# Altium schematic sheet SH2 - CONNECTORS.SchDoc: Connectors
size B; CheckedBy: Lance Bantoto; Engineer: Wolfgang Windholtz; Organization: UW Robotics; Address1: 200 University Avenue; Address2: Waterloo; Address3: Ontario; Address4: Canada N2L 3G6; Revision: 2; SheetNumber: 2; SheetTotal: 5
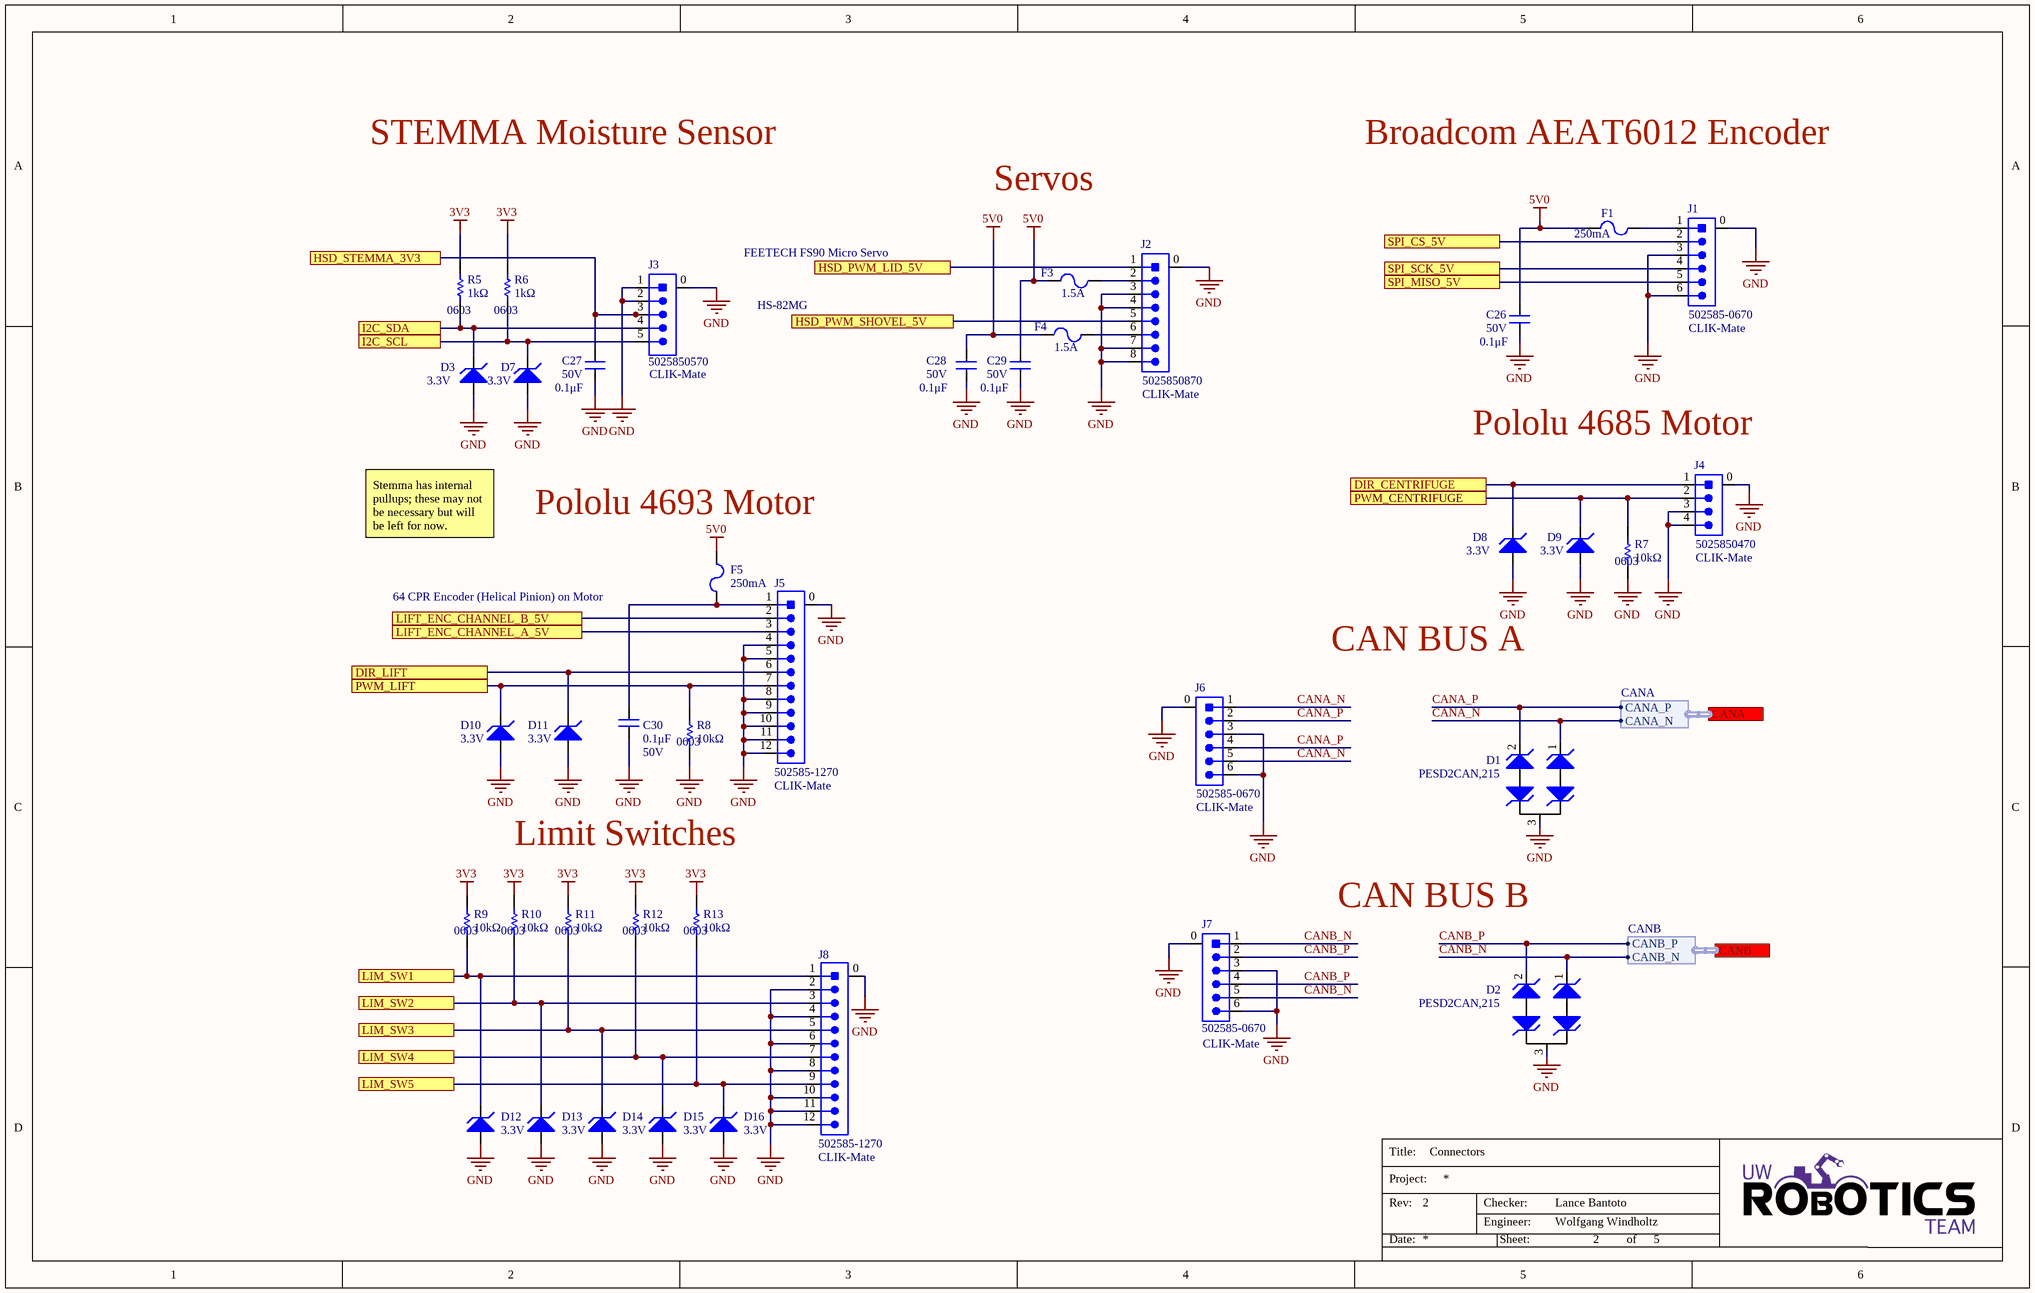
[diagram p0: SH2 - CONNECTORS.SchDoc]

## Parts
C26  value 0.1μF  Voltage Rating: 50V  [CAP0603]  (hidden comment: CAP_0.1uF_50V_0603)
C27  value 0.1μF  Voltage Rating: 50V  [CAP0603]  (hidden comment: CAP_0.1uF_50V_0603)
C28  value 0.1μF  Voltage Rating: 50V  [CAP0603]  (hidden comment: CAP_0.1uF_50V_0603)
C29  value 0.1μF  Voltage Rating: 50V  [CAP0603]  (hidden comment: CAP_0.1uF_50V_0603)
C30  value 0.1μF  Voltage Rating: 50V  [CAP0603]  (hidden comment: CAP_0.1uF_50V_0603)
D1  Manufacturer Part Number 1: PESD2CAN,215  [TVS_DIODE_CAN]  (hidden comment: TVS_DIODE_CAN)
D2  Manufacturer Part Number 1: PESD2CAN,215  [TVS_DIODE_CAN]  (hidden comment: TVS_DIODE_CAN)
D3  Reverse Standoff Voltage: 3.3V  [SOD523_UNI]  (hidden comment: ESD5Z3.3T1G)
D7  Reverse Standoff Voltage: 3.3V  [SOD523_UNI]  (hidden comment: ESD5Z3.3T1G)
D8  Reverse Standoff Voltage: 3.3V  [SOD523_UNI]  (hidden comment: ESD5Z3.3T1G)
D9  Reverse Standoff Voltage: 3.3V  [SOD523_UNI]  (hidden comment: ESD5Z3.3T1G)
D10  Reverse Standoff Voltage: 3.3V  [SOD523_UNI]  (hidden comment: ESD5Z3.3T1G)
D11  Reverse Standoff Voltage: 3.3V  [SOD523_UNI]  (hidden comment: ESD5Z3.3T1G)
D12  Reverse Standoff Voltage: 3.3V  [SOD523_UNI]  (hidden comment: ESD5Z3.3T1G)
D13  Reverse Standoff Voltage: 3.3V  [SOD523_UNI]  (hidden comment: ESD5Z3.3T1G)
D14  Reverse Standoff Voltage: 3.3V  [SOD523_UNI]  (hidden comment: ESD5Z3.3T1G)
D15  Reverse Standoff Voltage: 3.3V  [SOD523_UNI]  (hidden comment: ESD5Z3.3T1G)
D16  Reverse Standoff Voltage: 3.3V  [SOD523_UNI]  (hidden comment: ESD5Z3.3T1G)
F1  Current Rating: 250mA  [FUSE_1206]  (hidden comment: FUSE_250mA_1206)
F3  Current Rating: 1.5A  [FUSE_1206]  (hidden comment: FUSE_1.5A_1206)
F4  Current Rating: 1.5A  [FUSE_1206]  (hidden comment: FUSE_1.5A_1206)
F5  Current Rating: 250mA  [FUSE_1206]  (hidden comment: FUSE_250mA_1206)
J1  Manufactor Number: 502585-0670  Family: CLIK-Mate  [MOLEX-5025850670]  (hidden comment: CON_6M_SM_RA_1.5mm)
J2  Manufacturer Part Number: 5025850870  Family: CLIK-Mate  [MOLEX-5025850870]  (hidden comment: CON_8M_SM_RA)
J3  Manufacturer Part Number 1: 5025850570  Family: CLIK-Mate  [MOLEX-5025850570]  (hidden comment: CON_5M_SM_RA)
J4  Manufactor Number: 5025850470  Family: CLIK-Mate  [MOLEX-5025850470]  (hidden comment: CON_4M_SM_RA)
J5  Family: CLIK-Mate  Manufacturer Part Number 1: 502585-1270  [MOLEX-5025851270]  (hidden comment: CON_12M_SM_RA)
J6  Manufactor Number: 502585-0670  Family: CLIK-Mate  [MOLEX-5025850670]  (hidden comment: CON_6M_SM_RA_1.5mm)
J7  Manufactor Number: 502585-0670  Family: CLIK-Mate  [MOLEX-5025850670]  (hidden comment: CON_6M_SM_RA_1.5mm)
J8  Family: CLIK-Mate  Manufacturer Part Number 1: 502585-1270  [MOLEX-5025851270]  (hidden comment: CON_12M_SM_RA)
R5  value 1kΩ  Package/Footprint: 0603  [RESC0603]  (hidden comment: RES_1kΩ_0603_5%)
R6  value 1kΩ  Package/Footprint: 0603  [RESC0603]  (hidden comment: RES_1kΩ_0603_5%)
R7  value 10kΩ  Package/Footprint: 0603  [RESC0603]  (hidden comment: RES_10kΩ_0603_5%)
R8  value 10kΩ  Package/Footprint: 0603  [RESC0603]  (hidden comment: RES_10kΩ_0603_5%)
R9  value 10kΩ  Package/Footprint: 0603  [RESC0603]  (hidden comment: RES_10kΩ_0603_5%)
R10  value 10kΩ  Package/Footprint: 0603  [RESC0603]  (hidden comment: RES_10kΩ_0603_5%)
R11  value 10kΩ  Package/Footprint: 0603  [RESC0603]  (hidden comment: RES_10kΩ_0603_5%)
R12  value 10kΩ  Package/Footprint: 0603  [RESC0603]  (hidden comment: RES_10kΩ_0603_5%)
R13  value 10kΩ  Package/Footprint: 0603  [RESC0603]  (hidden comment: RES_10kΩ_0603_5%)

## Ports
CANA (harness CANA), CANB (harness CANB), DIR_CENTRIFUGE, DIR_LIFT, HSD_PWM_LID_5V, HSD_PWM_SHOVEL_5V, HSD_STEMMA_3V3, I2C_SCL, I2C_SDA, LIFT_ENC_CHANNEL_A_5V, LIFT_ENC_CHANNEL_B_5V, LIM_SW1, LIM_SW2, LIM_SW3, LIM_SW4, LIM_SW5, PWM_CENTRIFUGE, PWM_LIFT, SPI_CS_5V, SPI_MISO_5V, SPI_SCK_5V

## Harnesses
CANA: CANA_P, CANA_N
CANB: CANB_P, CANB_N

## Nets
3V3: R5.2 R6.2 R9.2 R10.2 R11.2 R12.2 R13.2
5V0: C26.2 C28.2 C29.2 F1.2 F3.1 F4.1 F5.2
GND: C26.1 C27.1 C28.1 C29.1 C30.1 D1.3 D2.3 D3.1(Anode) D7.1(Anode) D8.1(Anode) D9.1(Anode) D10.1(Anode) D11.1(Anode) D12.1(Anode) D13.1(Anode) D14.1(Anode) D15.1(Anode) D16.1(Anode) J1.0 J1.3 J1.6 J2.0 J2.3 J2.4 J2.7 J2.8 J3.0 J3.1 J3.2 J4.0 J4.3 J4.4 J5.0 J5.4 J5.5 J5.8 J5.9 J5.10 J5.11 J5.12 J6.0 J6.3 J6.6 J7.0 J7.3 J7.6 J8.0 J8.2 J8.4 J8.6 J8.8 J8.10 J8.11 J8.12 R7.1 R8.1
CANA_N: D1.1 J6.1 J6.5 ; port CANA.CANA_N
CANA_P: D1.2 J6.2 J6.4 ; port CANA.CANA_P
CANB_N: D2.1 J7.1 J7.5 ; port CANB.CANB_N
CANB_P: D2.2 J7.2 J7.4 ; port CANB.CANB_P
DIR_CENTRIFUGE: D8.2(Cathode) J4.1 ; port DIR_CENTRIFUGE
DIR_LIFT: D11.2(Cathode) J5.6 ; port DIR_LIFT
HSD_PWM_LID_5V: J2.1 ; port HSD_PWM_LID_5V
HSD_PWM_SHOVEL_5V: J2.5 ; port HSD_PWM_SHOVEL_5V
HSD_STEMMA_3V3: C27.2 J3.3 ; port HSD_STEMMA_3V3
I2C_SCL: D7.2(Cathode) J3.5 R6.1 ; port I2C_SCL
I2C_SDA: D3.2(Cathode) J3.4 R5.1 ; port I2C_SDA
LIFT_ENC_CHANNEL_A_5V: J5.3 ; port LIFT_ENC_CHANNEL_A_5V
LIFT_ENC_CHANNEL_B_5V: J5.2 ; port LIFT_ENC_CHANNEL_B_5V
LIM_SW1: D12.2(Cathode) J8.1 R9.1 ; port LIM_SW1
LIM_SW2: D13.2(Cathode) J8.3 R10.1 ; port LIM_SW2
LIM_SW3: D14.2(Cathode) J8.5 R11.1 ; port LIM_SW3
LIM_SW4: D15.2(Cathode) J8.7 R12.1 ; port LIM_SW4
LIM_SW5: D16.2(Cathode) J8.9 R13.1 ; port LIM_SW5
PWM_CENTRIFUGE: D9.2(Cathode) J4.2 R7.2 ; port PWM_CENTRIFUGE
PWM_LIFT: D10.2(Cathode) J5.7 R8.2 ; port PWM_LIFT
SPI_CS_5V: J1.2 ; port SPI_CS_5V
SPI_MISO_5V: J1.5 ; port SPI_MISO_5V
SPI_SCK_5V: J1.4 ; port SPI_SCK_5V
NetC30_2: C30.2 F5.1 J5.1
NetF1_1: F1.1 J1.1
NetF3_2: F3.2 J2.2
NetF4_2: F4.2 J2.6

## Notes on the sheet
- STEMMA Moisture Sensor
- Broadcom AEAT6012 Encoder
- Servos
- FEETECH FS90 Micro Servo
- HS-82MG
- (near J4) Pololu 4685 Motor
- Stemma has internal pullups; these may not be necessary but will be left for now.
- (near F5) Pololu 4693 Motor
- 64 CPR Encoder (Helical Pinion) on Motor
- CAN BUS A
- Limit Switches
- CAN BUS B
- Title:
- Project:
- Date:
- Rev:
- Checker:
- Engineer:
- Sheet:
- of

## Library data of the parts
C26-C30 = CAP_0.1uF_50V_0603: CAP CER 0.1UF 50V X7R 0603; Manufacturer Part Number 1: CC0603KRX7R9BB104; Manufacturer 1: Yageo; Package/Footprint: 0603; Temperature Coefficient: X7R; Supplier Part Number 1: 311-1344-1-ND; Supplier 1: Digi-Key; Dielectric: X7R; Mounting Type: SMD
D1 D2 = TVS_DIODE_CAN: TVS DIODE 24V 41V SOT323-3; Manufacturer 1: Nexperia USA Inc.; Supplier Part Number 1: 1727-3891-1-ND; Supplier 1: Digi-Key; Package/Footprint: SOT323-3; Mounting Type: SMD
D3 D7-D16 = ESD5Z3.3T1G: TVS DIODE 3.3V 14.1V SOD523; Manufacturer 1: ON Semiconductor; Peak Pulse Power: 158W; Number of Unidirectional Channels: 1; Min Breakdown Voltage: 5V; Power Line Protection: No; Peak Pulse Current: 11.2A; Polarity: Unidirectional; ESD Protection: Yes; Capacitance: 105pF; Max Reverse Leakage Current: 50nA; Max Power Dissipation: 200mW; Package/Footprint: SOD-523; Supplier 1: Digi-Key; Category: ESD and Circuit Protection ICs; Clamping Voltage: 14.1V; Number of Lines: 1; Breakdown Voltage: 5V; Number of Elements: 1; Max Breakdown Voltage: 5V; Reverse Breakdown Voltage: 5V; Max Surge Current: 11.2A; Direction: Unidirectional; Supplier Part Number 1: ESD5Z3.3T1GOSCT-ND; Manufacturer Part Number 1: ESD5Z3.3T1G; Mounting Type: SMD
F1 F5 = FUSE_250mA_1206: FUSE BOARD MNT 250MA 125VAC/VDC; Manufacturer 1: Littelfuse; Manufacturer Part Number 1: 0466.250NR; DC Cold Resistance: 31mR; Power Dissipation: 157.5mW; Approvals: UL,CSA; Working Voltage: 250V; Package/Footprint: 1206; Supplier 1: Digi-Key; Current: 250mA; Length: 3.18mm; Height: 0.023inch; Width: 0.06inch; Depth: 1.52mm; Supplier Part Number 1: F1452CT-ND; Mounting Type: SMD
F3 F4 = FUSE_1.5A_1206: FUSE SMD 1.5A 63V; Manufacturer 1: Littelfuse; Manufacturer Part Number 1: 046601.5NR; Fuse Type: Board Mount (Cartridge Style Excluded); DC Cold Resistance: 31mR; Power Dissipation: 157.5mW; Approvals: UL,CSA; Package/Footprint: 1206; Supplier 1: Digi-Key; Housing Material: Ceramic; Min Operating Temperature: -55°C; Max Operating Temperature: 90°C; Voltage Rating (AC): 63V; Voltage Rating (DC): 63V; Current: 1.5A; Length: 3.18mm; Height: 0.023inch; Width: 0.06inch; Depth: 1.52mm; Supplier Part Number 1: F1462CT-ND; Mounting Type: SMD
J1 J6 J7 = CON_6M_SM_RA_1.5mm: CONN HEADER SMD RIGHT ANGLE 1.5 MM PITCH; Manufacturer: Molex; Supplier 1: Digi-Key; Supplier Part Number 1: WM12832CT-ND; Package/Footprint: SMD; Mounting Type: SMD
J2 = CON_8M_SM_RA: CONN HEADER SMD RIGHT ANGLE 1.5 MM PITCH; Manufacturer: Molex; Current Rating: 2A; Voltage Rating: 100V; Contact Resistance: 20mR; Number of Positions: 8; Connector Type: Receptacle,Center Strip Contact; Gender: Receptacle; Pitch: 1.5mm; Glow Wire Compliant: Non-compliant; Supplier 1: Digi-Key; Category: Headers and Wire Housings; Contact Plating: Tin; Contact Material: Copper,Copper Alloy,Tin; Color: Beige; Housing Color: Beige; Housing Material: Resin; Min Operating Temperature: -40°C; Max Operating Temperature: 85°C; Number of Rows: 1; Contact Gender: Female; Fastening Type: Latch; Orientation: Right Angle; Termination: Solder; Number of Contacts: 8; Number of Circuits: 8; Length: 16.3mm; Depth: 7.3mm; REACH SVHC: Unknown; Supplier Part Number 1: WM14471CT-ND; Mounting Type: SMD; Package/Footprint: SMD
J3 = CON_5M_SM_RA: CONN HEADER SMD RIGHT ANGLE 1.5MM PITCH; Manufacturer 1: Molex; Connector Type: Receptacle,Center Strip Contact; Number of Positions: 5; Current Rating: 2A; Supplier 1: Digi-Key; Termination: Solder; Number of Contacts: 5; Orientation: Right Angle; Number of Circuits: 5; Number of Rows: 1; Supplier Part Number 1: WM14469CT-ND; Mounting Type: SMD; Package/Footprint: SMD
J4 = CON_4M_SM_RA: CONN HEADER SMD RIGHT ANGLE 1.5 MM PITCH; Manufacturer: Molex; Supplier 1: Digi-Key; Supplier Part Number 1: WM9449CT-ND; Package/Footprint: SMD; Mounting Type: SMD
J5 J8 = CON_12M_SM_RA: CONN HEADER SMD RIGHT ANGLE 1.5MM PITCH; Manufacturer 1: Molex; Number of Positions: 12; Connector Type: Receptacle,Center Strip Contact; Current Rating: 2A; Gender: Receptacle; Voltage Rating: 100V; Supplier 1: Digi-Key; Contact Plating: Tin; Contact Material: Copper Alloy,Copper,Tin; Color: Beige; Housing Material: Thermoplastic; Termination: Solder; Contact Gender: Female; Number of Contacts: 12; Number of Rows: 1; Orientation: Right Angle; Fastening Type: Latch; Number of Circuits: 12; Pitch: 1.5mm; Supplier Part Number 1: WM14473CT-ND; Mounting Type: SMD; Package/Footprint: SMD
R5 R6 = RES_1kΩ_0603_5%: RES 1K OHM 5% 1/10W 0603; Manufacturer 1: Yageo; Manufacturer Part Number 1: RC0603JR-071KL; Supplier Part Number 1: 311-1.0KGRCT-ND; Supplier 1: Digi-Key; Tolerance: 5%; Mounting Type: SMD
R7-R13 = RES_10kΩ_0603_5%: RES 10K OHM 5% 1/10W 0603; Manufacturer 1: Yageo; Manufacturer Part Number 1: RC0603JR-0710KL; Package: 0603 (1608 Metric); Supplier Part Number 1: 311-10KGRCT-ND; Supplier 1: Digi-Key; Case Code (Metric): 1608; Tolerance: 5%; Mounting Type: SMD